# EAGLE design Adafruit PowerBoost 500 Basic (EAGLE 8.2.1)
COMPANY: ADAFRUIT INDUSTRIES; DRAWN: KTOWN; REV: A
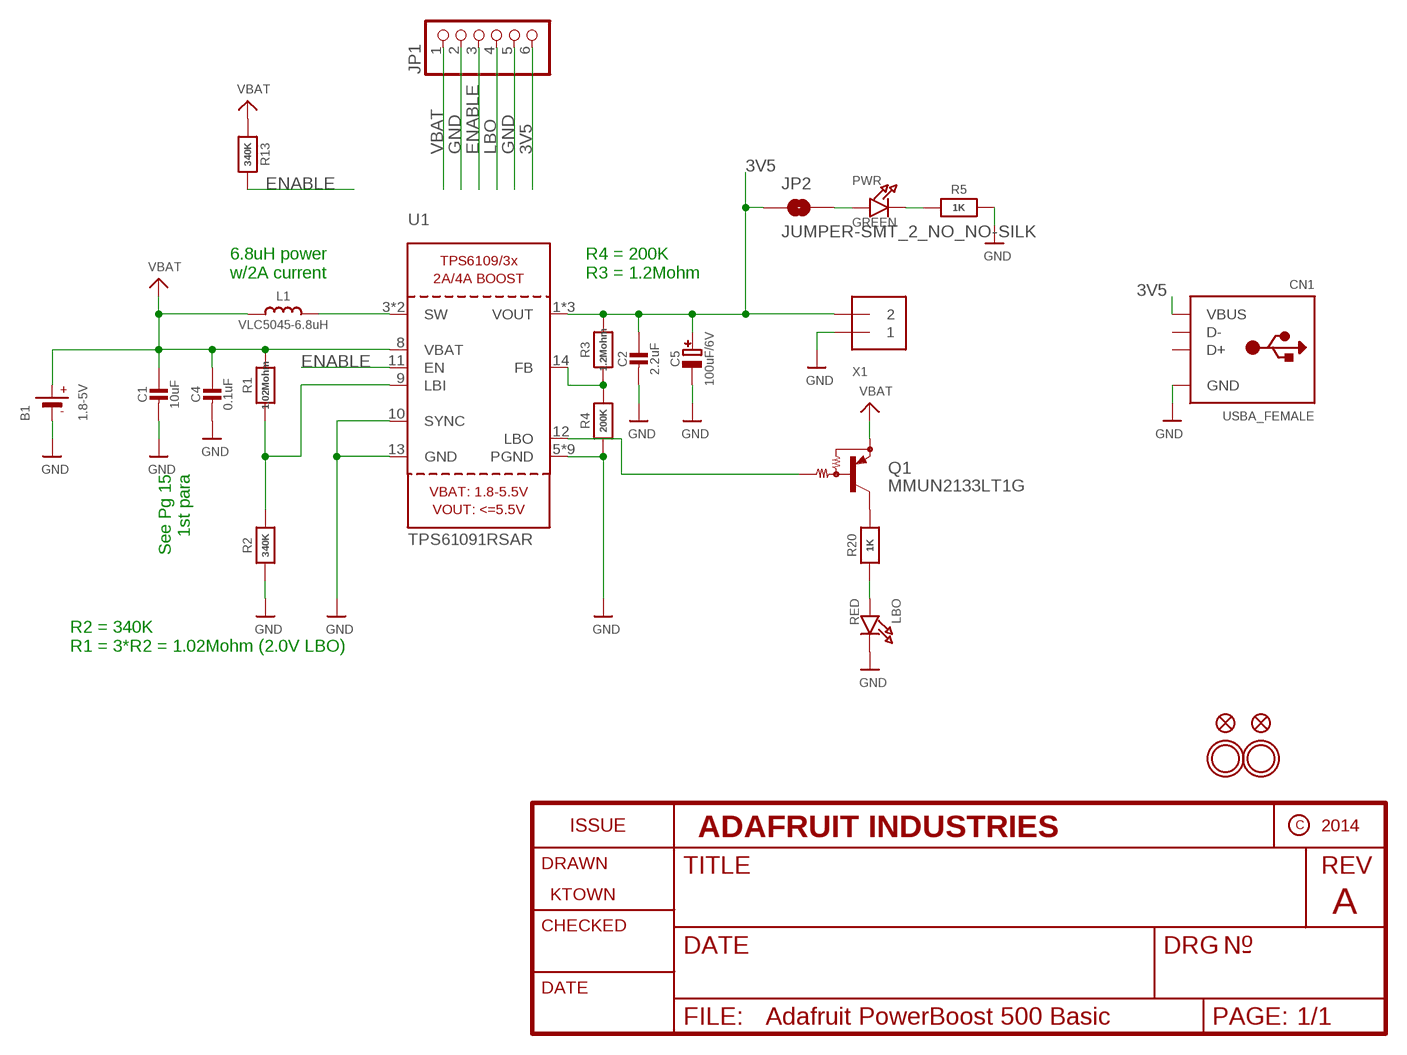
[diagram p0: schematic, sheet 1]

## Parts
B1  1.8-5V  BATTERY  [JSTPH2]
C1  10uF  CAP_CERAMIC0805-NOOUTLINE  [0805-NO]
C2  2.2uF  CAP_CERAMIC0805-NOOUTLINE  [0805-NO]
C4  0.1uF  CAP_CERAMIC0805-NOOUTLINE  [0805-NO]
C5  100uF/6V  CAP_TANTALUMB/3528_REFLOW  [EIA3528-21/B-R]
CN1  USBA_FEMALE  USB_TYPEAPTHFML  [USB_HOST-PTH]
FID2  FIDUCIAL""  [FIDUCIAL_1MM]
FID3  FIDUCIAL""  [FIDUCIAL_1MM]
JP1  PINHD-1X6CB  [1X06-CLEANBIG]
JP2  JUMPER-SMT_2_NO_NO-SILK  [SMT-JUMPER_2_NO_NO-SILK]
L1  VLC5045-6.8uH  INDUCTORTDK_VLC5045  [INDUCTOR_5X5MM_TDK_VLC5045]
LBO  RED  LED0805_NOOUTLINE  [CHIPLED_0805_NOOUTLINE]
PWR  GREEN  LED0805_NOOUTLINE  [CHIPLED_0805_NOOUTLINE]
Q1  MMUN2133LT1G  MUN2114T1-PNP_DRIVER-SC59-BEC  [SC59-BEC]
R1  1.02Mohm  RESISTOR0805_NOOUTLINE  [0805-NO]
R2  340K  RESISTOR0805_NOOUTLINE  [0805-NO]
R3  1.2Mohm  RESISTOR0805_NOOUTLINE  [0805-NO]
R4  200K  RESISTOR0805_NOOUTLINE  [0805-NO]
R5  1K  RESISTOR0805_NOOUTLINE  [0805-NO]
R13  340K  RESISTOR0805_NOOUTLINE  [0805-NO]
R20  1K  RESISTOR0805_NOOUTLINE  [0805-NO]
U1  TPS61091RSAR  VREG_TPS6103X  [PVQFN-16]
U$10  MOUNTINGHOLE2.5  [MOUNTINGHOLE_2.5_PLATED]
U$12  MOUNTINGHOLE2.5  [MOUNTINGHOLE_2.5_PLATED]
X1  TERMBLOCK_1X2  [TERMBLOCK_1X2-3.5MM]

## Nets
3V5: C2.1 C5.+ CN1.VBUS JP1.6 JP2.1 R3.2 U1.1(VOUT) U1.15(VOUT) U1.16(VOUT) X1.2
ENABLE: JP1.3 R13.2 U1.11(EN)
GND: B1.1(-) C1.2 C2.2 C4.2 C5.- CN1.GND JP1.2 JP1.5 LBO.C R2.1 R4.1 R5.2 U1.5(PGND) U1.6(PGND) U1.7(PGND) U1.10(SYNC) U1.13(GND) U1.P$18(PGND) U1.P$19(PGND) U1.P$20(PGND) U1.P$21(PGND) U1.P$22(PGND) U1.THERMAL(PGND) X1.1
LBO: JP1.4 Q1.B U1.12(LBO)
N$1: L1.P$2 U1.3(SW) U1.4(SW)
N$2: LBO.A R20.1
N$3: R1.1 R2.2 U1.9(LBI)
N$4: PWR.C R5.1
N$5: R3.1 R4.2 U1.14(FB)
N$6: JP2.2 PWR.A
N$10: Q1.C R20.2
VBAT: B1.2(+) C1.1 C4.1 JP1.1 L1.P$1 Q1.E R1.2 R13.1 U1.8(VBAT)
Unconnected: CN1.D+ CN1.D-

## Notes on the sheet
- 6.8uH power
  w/2A current
- R4 = 200K
  R3 = 1.2Mohm
- See Pg 15
  1st para
- R2 = 340K
  R1 = 3*R2 = 1.02Mohm (2.0V LBO)

## Library data of the parts
B1 = microbuilder:BATTERY: CR1220 SMT - Digikey: 3001K-ND CD2032 BAT-HLD-001 - Digikey: BAT-HLD-001-ND
C1 C2 C4 = microbuilder:CAP_CERAMIC: Ceramic Capacitors For new designs, use the packages preceded by an '_' character since they are more reliable: The following footprints should be used on most boards: _0402 - Standard footprint for regular board layouts _0603 - Standard footprint for regular board layouts _0805 - Standard footprint for regular board layouts _1206 - Standard footprint for regular board layouts For extremely tight-pitch boards where space is at a premium, the following 'micro-pitch' footprints can be used (smaller pads, no silkscreen outline, etc.): _0402MP - Micro-pitch footprint for very dense/compact boards _0603MP - Micro-pitch footprint for very dense/compact boards _0805MP - Micro-pitch footprint for very dense/compact boards _1206MP - Micro-pitch footprint for very dense/compact boards
C5 = microbuilder:CAP_TANTALUM: Tantalum Capacitors Wave footprints have larger pads and are meant to be used for hand soldering. Reflow footprints are optimised for solder paste and a reflow oven. EIA3216-18/A-[R/W] - Size A / 3216-18 / 1206 footprint 4.7µF 25V 10% Tantalum Capacitor 10µF 16V 10% Tantalum Capacitor [Digikey: 495-2236-2-ND] EIA3528-21/B-[R/W] - Size B / 3528-21 47µF 10V 10% Tantalum Capactior [Digikey: 495-2216-1-ND] EIA6032-28/C-[R/W] - Size C / 6032-28 10µF 35V 20% Tantalum Capacitor [Digikey: 495-2285-1-ND] 100µF 16V 10% Tantalum Capactior [Digikey: 399-5214-1-ND]
CN1 = microbuilder:USB_TYPEA: USB - Type A Connectors Male types stick out and are inserted into a PC or matching females parts (these are the connectors used on USB Memory Sticks, etc.). Female parts are generally used for USB Host and accept a male-type connector. SMT - 4UCON: 10017 PTHFML - Digikey: 609-1045-ND, 4UCon: 05241 PCB - Use 2.0mm thick PCBs with this footprint
FID2 FID3 = microbuilder:FIDUCIAL: Fiducial Alignment Points Various fiducial points for machine vision alignment.; BOM: EXCLUDE
JP1 = adafruit:PINHD-1X6: PIN HEADER
JP2 = SparkFun-Jumpers:JUMPER-SMT_2_NO: Normally open jumper This jumper has two pads in close proximity to each other. Apply solder to close the connection. Round pads are easier to solder for beginners, but are a lot larger. SparkFun Product that uses the round pads: SparkFun EL Sequencer <https://www.sparkfun.com/products/12781>
L1 = microbuilder:INDUCTOR: Inductors 0603: 10nH Ceramic Inductor - microwire antenna/RF (Digikey: 712-1434-2-ND) 0805: 560nH Ceramic Inductor - RF (Digikey: 553-1047-1-ND) 270nH Ceramic Inductor - Q = 40@250MHz, +-5%, 1 Ohm DC Resistance (Digikey: 535-10506-2-ND) 1007 (2518 Metric) SMT: 10µH 10% 250mOhm 820mA 1007 Inductor (Digikey: 587-2189-1-ND) 22µH 10% 500mOhm 580mA 1007 Inductor (Digikey: 587-2190-1-ND) 47µH 10% 950mOhm 420mA 1007 Inductor (Digikey: 587-2191-1-ND) 47µH 5% 100mOhm 1A 1008 Inductor (Digikey: 732-1816-1-ND) 5.0x5.0mm (Taiyo Yuden NR5040 Series) 6.8µH 20% 2.3A 64mOhm Inductor (Digikey: 587-2374-2-ND) 5.0x5.0mm (TDK VLC5045 Series) 4.7µH 20% 3.3A 34mOhm Inductor (Digikey: 445-6526-1-ND) 6.8µH 20% 2.7A 46mOhm Inductor (Digikey: 445-6527-1-ND) 6.0x6.0mm (TDK VLC6045 Series) 4.7µH 20% 3.8A 27mOhm Inductor (Digikey: 445-6538-2-ND) 6.8µH 20% 3A 41mOhm Inductor (Digikey: 445-6540-1-ND) 6.2µH 30% 2.2A 45mOhm Inductor (Digikey: SRR5028-6R2YCT-ND) - Not TDK VLC6045 but footprint should match 6.0x6.0mm (TDK SLF6045 Series) 6.8uH 30% 2A 33mOhm Inductor (Digikey: 445-4572-1-ND, Mouser: 810-SLF645T6R8N2R0PF) 6.0x6.0mm (Sumida CDRH5D28 Series) 6.2uH 30% 1.8A 45mOhm Inductor (Digikey: 308-1542-1-ND) Taiyo Yuden NR3015T2R2M - 2.2uH 20% 1.5A (Digikey: 587-1648-2-ND, Mouser: 963-NR3015T2R2M) - Used with TI TPS62172 CoilCraft RFID Transponder Coil - MA5532-AE (For use with AS3935 Lightning Sensor)
LBO PWR = microbuilder:LED: LED 0603 - 0603 Surface Mount Package 2mA: Green LED - Low Power (3.9mcd, 2ma, 1.7Vf) - Digikey: 475-2709-2-ND Orange LED - Low Power (9.8mcd, 2ma, 1.8Vf) - Digikey: 475-1194-2-ND Red LED - Low Power (5mcd, 2ma, 1.8Vf) - Digikey: 475-1195-2-ND Yellow LED - Low Power (7mcd, 2ma, 1.8Vf) - Digikey: 475-1196-2-ND 5mA: Blue LED - Low Power (17mcd, 5ma, 2.9Vf) - Digikey: LNJ937W8CRACT-ND 0805 - 0805 Surface Mount Package 2mA: Red LED (8.8mcd, 2mA, 1.8Vf, Clear) - Low Power [Digikey: 475-2510-1-ND] Green LED (5mcd, 2mA, 1.8Vf, Clear) - Low Power [Digikey: 475-2730-1-ND] Yellow LED (11.3mcd, 2mA, 1.8Vf, Clear) - Low Power [Digikey: 475-2555-1-ND] 20mA: Red LED (104mcd, 20mA, Diffused) - LS R976 [Digikey: 475-1278-6-ND] Red LED (12mcd, 20mA, 2.0Vf, Clear) - APT2012EC [Digikey: 754-1128-1-ND] Green LED (15mcd, 20mA, 2.2Vf, Clear) - APT2012GC [Digikey: 754-1131-1-ND] Orange LED (160mcd, 20mA, 2.1Vf, Clear) - APT2012SECK [Digikey: 754-1130-1-ND] 1206 - 1206 Surface Mount Package Green LED (26mcd, 20mA, Diffused) - LG N971 [Digikey: 475-1407-6-ND] Red LED (15mcd, 20mA, Diffused) - LH N974 [Digikey: 475-1416-6-ND] Cree - Cree High-Power Surface Mount LEDs XPEBWT-L1-0000-00D50 - White 111lm 350mA 2.9Vf 6200K 110° XTEAWT-00-0000-00000LEE3 - White 114lm 350mA 2.85Vf 5000K 115° Everlight - Everlight 45-21 Series Surface Mount LEDs 45-21/QK2C-B2832AC2CB2/2T - Warm White 2000mcd 20mA 3.25Vf 3050K 120° 45-21/LK2C-B38452C4CB2/2T - Nuetral White 2000mcd 20mA 3.25Vf 4150K 120° 45-21/LK2C-B50634C6CB2/2T - Cold White 2200mcd 20mA 3.25Vf 5650K 120° PLCC2 Reverse Mount LS T77K-J1L2-1-0-2-R18-Z - Red 11.25mcd 2mA 1.8Vf 630nm 120° LO T77K-L1M2-24-Z - Orange 19.6mcd 2mA 1.8Vf 606nm 120° LY T77K-K2M1-26-Z - Yellow 15.7mcd 2mA 1.8Vf 587nm 120°
Q1 = transistor:*-PNP_DRIVER-: PNP Bias Resistor Transistor
R1-R5 R13 R20 = microbuilder:RESISTOR: Resistors For new designs, use the packages preceded by an '_' character since they are more reliable: The following footprints should be used on most boards: _0402 - Standard footprint for regular board layouts _0603 - Standard footprint for regular board layouts _0805 - Standard footprint for regular board layouts _1206 - Standard footprint for regular board layouts For extremely tight-pitch boards where space is at a premium, the following 'micro-pitch' footprints can be used (smaller pads, no silkscreen outline, etc.): _0402MP - Micro-pitch footprint for very dense/compact boards _0603MP - Micro-pitch footprint for very dense/compact boards _0805MP - Micro-pitch footprint for very dense/compact boards _1206MP - Micro-pitch footprint for very dense/compact boards
U1 = microbuilder:VREG_TPS6103X: TPS6103x 4A Boost - 1.8-5.5V Input, Adjustable Output to 5.5V
U$10 U$12 = microbuilder:MOUNTINGHOLE: Mounting Hole For #2 screws (0.086"/2.18mm width, 0.094"/2.4mm hole) use 2.5mm; BOM: EXCLUDE
X1 = microbuilder:TERMBLOCK_1X2: 3.5mm Terminal block http://www.ladyada.net/library/pcb/eaglelibrary.html

## Board
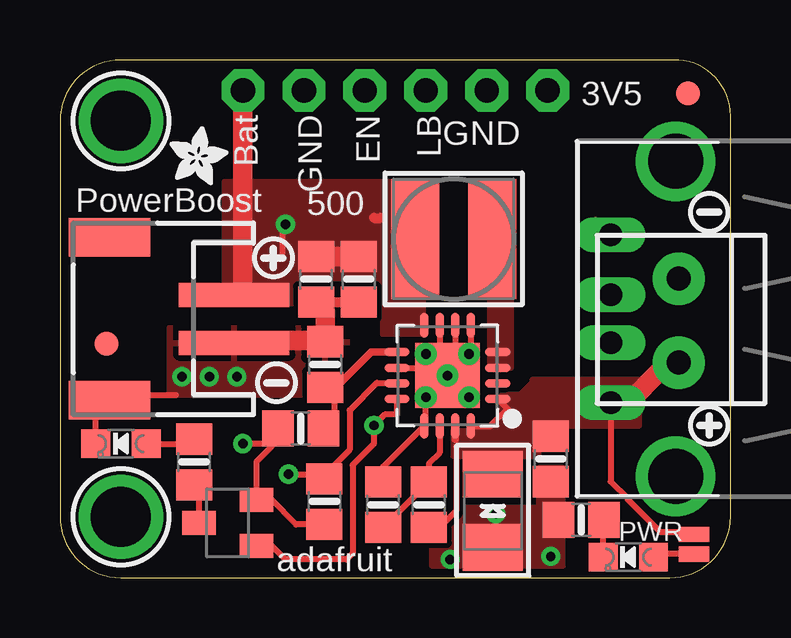
[diagram p1: board, top side]
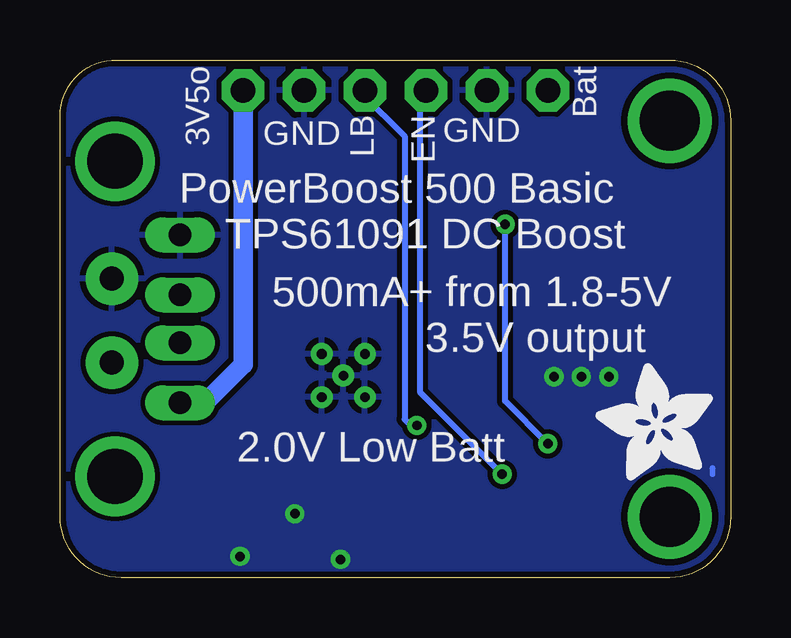
[diagram p2: board, bottom side, seen from below]

Size 27.95 x 21.59 mm. Coordinates in mm from the lower left corner, seen from the top.
Outline: 0,19.05 0,2.54 arc90 2.54,0 25.4,0 arc90 27.94,2.54 27.94,19.05 arc90 25.78,21.59 2.54,21.59 arc90 0,19.05
Copper layers (1*16): Top 0.035mm / dielectric 1.5mm / Bottom 0.035mm
Design rules "adafruit *": minimum track width 8mil, minimum drill 15.5mil, track to track 8mil, track to pad 8mil, pad to pad 8mil, via to via 8mil, smd to smd 8mil, copper to edge 10mil, drill to drill 8mil, minimum pad ring 10mil, minimum via ring 8mil, stop-mask expansion 2mil, vias tented up to drill 20mil, thermal gap 10mil

### Footprints (pad centres in the part's own frame; a part is rotated, then mirrored left to right if it is on the bottom)
JSTPH2 = smd 1 x 4.6: 1 -1,-3.7; 2 1,-3.7 | smd 1.6 x 3.4: NC1 -3.4,1.5; NC2 3.4,1.5
0805-NO = smd 1.3 x 1.5: 1 -0.95,0; 2 0.95,0
EIA3528-21/B-R = smd 1.95 x 2.5: + 1.525,0; - -1.525,0
USB_HOST-PTH = drill 0.95 long: D+ 1,6.52; D- -1,6.52; GND 3.5,6.52; VBUS -3.5,6.52 | drill 2.3 pad 2.9: S1 -6.57,3.81; S2 6.57,3.81
FIDUCIAL_1MM = smd 1 x 1: 1 0,0
1X06-CLEANBIG = drill 1.016 pad 1.778 octagon: 1 -6.35,0; 2 -3.81,0; 3 -1.27,0; 4 1.27,0; 5 3.81,0; 6 6.35,0
SMT-JUMPER_2_NO_NO-SILK = smd 0.635 x 1.27: 1 -0.406,0; 2 0.406,0
INDUCTOR_5X5MM_TDK_VLC5045 = smd 2 x 5: P$1 -1.6,0; P$2 1.6,0
CHIPLED_0805_NOOUTLINE = smd 1.2 x 1.2: A 0,-1.05; C 0,1.05
SC59-BEC = smd 1 x 1.4: B -0.95,-1.2; C 0,1.2; E 0.95,-1.2
PVQFN-16 = smd 1.05 x 0.35: 1 -2.1,0.975; 2 -2.1,0.325; 3 -2.1,-0.325; 4 -2.1,-0.975; 9 2.1,-0.975; 10 2.1,-0.325; 11 2.1,0.325; 12 2.1,0.975 | smd 0.35 x 1.05: 5 -0.975,-2.1; 6 -0.325,-2.1; 7 0.325,-2.1; 8 0.975,-2.1; 13 0.975,2.1; 14 0.325,2.1; 15 -0.325,2.1; 16 -0.975,2.1 | drill 0.4: P$18 0,0; P$19 -0.9,0.9; P$20 0.9,0.9; P$21 0.9,-0.9; P$22 -0.9,-0.9 | smd 2.7 x 2.7: THERMAL 0,0
MOUNTINGHOLE_2.5_PLATED = drill 2.5 pad 3.2: P$1 0,0
TERMBLOCK_1X2-3.5MM = drill 1 pad 2.184: 1 1.8,0; 2 -1.7,0

### Placement (x,y rotation side)
B1  3.56,10.79 90 top
C1  10.67,12.45 270 top
C2  20.45,4.95 270 top
C4  12.45,12.45 270 top
C5  18.03,2.79 90 top
CN1  29.46,10.79 90 top
FID2  1.93,9.76 0 top
FID3  26.16,20.19 0 top
JP1  13.97,20.32 0 top
JP2  26.42,1.4 270 top
L1  16.4,14.13 0 top
LBO  2.54,5.59 90 top
PWR  23.68,0.86 90 top
Q1  6.99,2.29 90 top
R1  10.03,6.22 180 top
R2  11.05,8.89 270 top
R3  15.37,3.05 270 top
R4  13.46,3.05 270 top
R5  21.72,2.41 180 top
R13  11.02,3.17 90 top
R20  5.59,4.83 270 top
U1  16.14,8.43 180 top
U$10  2.54,19.05 0 top
U$12  2.54,2.54 0 top
U$13  [SYMBOL_PLUS]  8.89,13.34 0 top
U$23  [SYMBOL_MINUS]  9.02,8.13 0 top
U$25  [SYMBOL_PLUS]  27.05,6.35 0 top
U$26  [SYMBOL_MINUS]  27.05,15.24 0 top
U$28  [ADAFRUIT_2.5MM]  4.57,16.38 0 top
U$29  [ADAFRUIT_5MM]  0.76,4.06 90 bottom
X1  25.78,10.67 90 top

### Tracks (layer width: path | path; a pad name or v marks a point on that pad's centre or on a via)
3V5
  Top 0.254: 23.11,7.12 CN1.VBUS 22.94,4 23.65,3.3 23.65,3.28 25.02,1.91 26.31,1.91 JP2.1 | U1.1 18.65,7.05 17.93,6.33 U1.16 | 16.51,5.46 16.51,2.79 15.81,2.1 R3.2
  Top 0.305: U1.15 16.47,5.76
  Top 0.813: 23,6.99 23.37,6.99 25.35,8.97 X1.2
  Bottom 0.813: JP1.6 20.32,8.89 21.91,7.29 CN1.VBUS
  pour Top (no thermals): 16.38,6.1 16.38,5.08 19.94,5.08 19.94,6.35 24.13,6.35 24.13,8.26 19.68,8.26 19.68,8.13 19.18,7.62 18.41,7.62 18.41,6.6 17.91,6.1
ENABLE  (via drill 0.39)
  Top 0.254: U1.11 14.02,8.13 13.21,8.13 12.06,6.99 12.06,5.33 10.86,4.12 R13.2 10.82,4.32 v9.53,4.32
  Bottom 0.254: JP1.3 12.7,20.19 12.95,19.94 12.95,7.75 v9.53,4.32
GND  (via drill 0.39)
  Top 0.254: U1.P$21 15.65,8.92 | 15.65,8.92 U1.THERMAL | U1.THERMAL 16.62,8.91 | 16.62,8.91 U1.P$22 17.12,9.4 U1.5 | U1.THERMAL U1.P$19 | U1.THERMAL U1.P$20 15.24,6.4 U1.13 13.46,4.62 R4.1 | U1.10 15.82,8.75 U1.THERMAL | U1.7 15.82,9.09 15.65,8.92 | U1.6 16.47,9.06 16.62,8.91 | 1.49,5.3 LBO.C 1.49,7.08 2.03,7.62 4.83,7.62 | 22.31,14.93 CN1.GND
  Top 0.406: C1.2 C4.2
  Top 0.813: 10.46,9.89 8.7,9.89 | C1.2 11.05,11.12 R2.1
  Bottom 0.254: 0.76,4.57 0.76,4.32
  other vias: 7.37,8.38 18.16,2.67 5.08,8.38 6.22,8.38 16.26,0.76 20.45,0.89
  pour Bottom: 0,22.1 0,0 27.94,0 28.57,22.1
  pour Top (no thermals): 15.49,2.92 15.49,0.51 20.95,0.51 20.95,4.57 19.94,4.57 19.94,2.92
  pour Top: 4.57,10.41 11.94,10.41 11.94,7.62 4.57,7.62
LBO  (via drill 0.39)
  Top 0.254: U1.12 14.04,6.8 13.54,6.8 v13.08,6.35 13.08,5.59 12.19,4.7 12.19,1.02 11.94,0.76 9.39,0.76 8.82,1.34 Q1.B
  Bottom 0.254: JP1.4 15.37,20.19 13.59,18.41 13.59,6.6 13.34,6.35 v13.08,6.35
N$1
  pour Top (no thermals): 17.91,8.76 18.8,8.76 18.8,16 17.4,16 17.4,12.19 17.91,11.68
N$2
  Top 0.254: LBO.A 5.4,5.59 R20.1
N$3
  Top 0.254: R2.2 11.43,7.56 11.43,6.67 R1.1
  Top 0.305: U1.9 12.96,9.4 11.5,7.94 R2.2
N$4
  Top 0.254: PWR.C 22.63,2.38 R5.1
N$5
  Top 0.254: U1.14 15.82,5.21 15.37,4.76 R3.1 | R3.1 15.24,3.87 | R4.2 R3.1
N$6
  Top 0.254: JP2.2 24.86,0.99 PWR.A
N$10
  Top 0.254: R20.2 5.79,3.68 Q1.C
VBAT  (via drill 0.39)
  Top 0.254: v7.62,5.59 8.7,5.59 8.7,5.84 R1.2 8.82,5.96 8.82,5.47 8.19,4.83 Q1.E 8.82,3.24 9.83,2.22 R13.1 | 9.27,13.56 9.27,14.61
  Top 0.406: 13.08,15 13.35,15
  Top 0.813: C4.1 C1.1 | JP1.1 7.62,12.14
  Bottom 0.254: v7.62,5.59 9.4,7.37 v9.4,14.73
  pour Top (no thermals): 6.86,16.51 15.11,16.51 15.11,10.16 13.46,10.16 13.46,11.43 6.86,11.43

### Text on the board
tPlace: 3V5 | Bat | GND | EN | LB | GND | PowerBoost | 500 | PWR | adafruit
bPlace: Bat | 3V5o | GND | EN | LB | GND | PowerBoost 500 Basic | TPS61091 DC Boost | 500mA+ from 1.8-5V | 3.5V output | 2.0V Low Batt